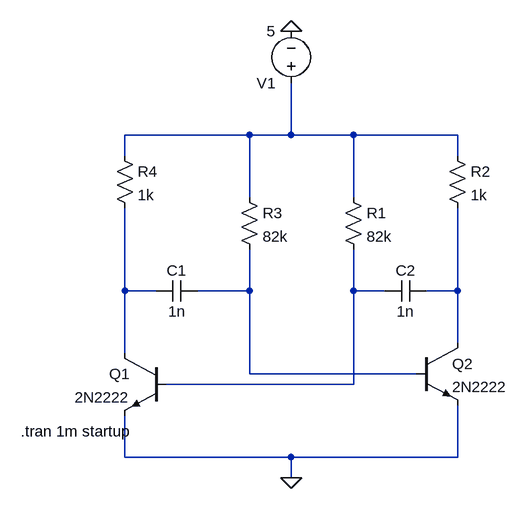
[diagram p0: schematic Task_1_Electronics.asc]
Task_1_Electronics.asc, the LTspice schematic file:
Version 4
SHEET 1 880 680
WIRE -80 16 -272 16
WIRE -16 16 -16 -64
WIRE -16 16 -80 16
WIRE 80 16 -16 16
WIRE 240 16 80 16
WIRE -272 48 -272 16
WIRE 240 48 240 16
WIRE -80 112 -80 16
WIRE 80 112 80 16
WIRE -272 256 -272 128
WIRE -224 256 -272 256
WIRE -80 256 -80 192
WIRE -80 256 -160 256
WIRE 80 256 80 192
WIRE 128 256 80 256
WIRE 240 256 240 128
WIRE 240 256 192 256
WIRE 240 336 240 256
WIRE -272 352 -272 256
WIRE -80 384 -80 256
WIRE 176 384 -80 384
WIRE 80 400 80 256
WIRE 80 400 -208 400
WIRE -272 512 -272 448
WIRE -16 512 -272 512
WIRE 240 512 240 432
WIRE 240 512 -16 512
WIRE -16 544 -16 512
FLAG -16 -144 0
FLAG -16 544 0
SYMBOL res 64 96 R0
SYMATTR InstName R1
SYMATTR Value 82k
SYMBOL res 224 32 R0
SYMATTR InstName R2
SYMATTR Value 1k
SYMBOL res -96 96 R0
SYMATTR InstName R3
SYMATTR Value 82k
SYMBOL res -288 32 R0
SYMATTR InstName R4
SYMATTR Value 1k
SYMBOL cap -160 240 R90
WINDOW 0 0 32 VBottom 2
WINDOW 3 32 32 VTop 2
SYMATTR InstName C1
SYMATTR Value 1n
SYMBOL cap 192 240 R90
WINDOW 0 0 32 VBottom 2
WINDOW 3 32 32 VTop 2
SYMATTR InstName C2
SYMATTR Value 1n
SYMBOL npn -208 352 M0
SYMATTR InstName Q1
SYMATTR Value 2N2222
SYMBOL npn 176 336 R0
SYMATTR InstName Q2
SYMATTR Value 2N2222
SYMBOL voltage -16 -48 R180
WINDOW 123 0 0 Left 2
WINDOW 39 0 0 Left 2
SYMATTR InstName V1
SYMATTR Value 5
TEXT -432 472 Left 2 !.tran 1m startup

The netlist it stands for:
* Task_1_Electronics.asc
R1 N001 N004 82k
R2 N001 N005 1k
R3 N001 N003 82k
R4 N001 N002 1k
C1 N003 N002 1n
C2 N005 N004 1n
Q1 N002 N004 0 0 2N2222
Q2 N005 N003 0 0 2N2222
V1 N001 0 5
.model NPN NPN
.model PNP PNP
.lib standard.bjt
.tran 1m startup
.backanno
.end